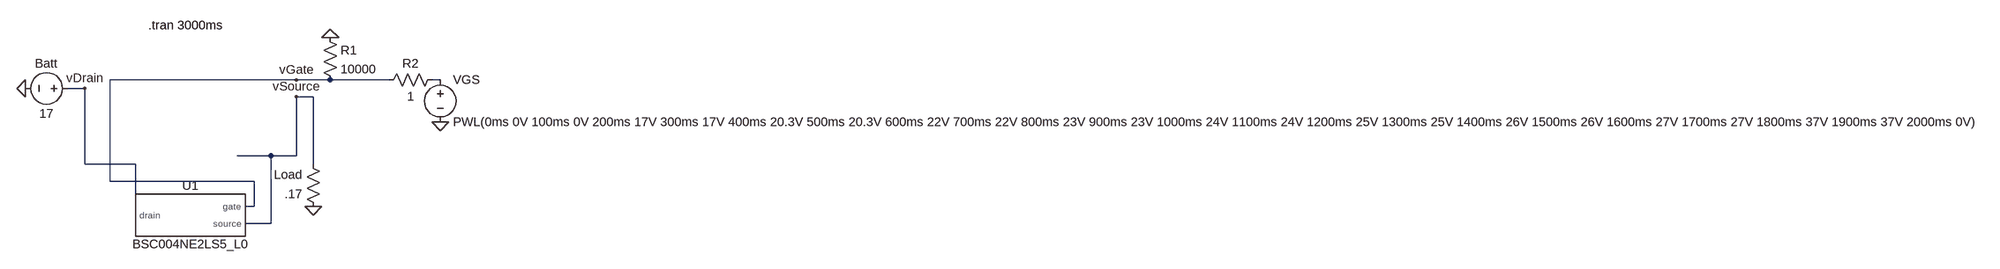
[diagram p0: schematic x_NMOS_SIM.asc]
x_NMOS_SIM.asc, the LTspice schematic file:
Version 4
SHEET 1 3888 808
WIRE 544 304 192 304
WIRE 608 304 544 304
WIRE 720 304 608 304
WIRE 816 304 800 304
WIRE 144 320 112 320
WIRE 576 336 544 336
WIRE 496 448 432 448
WIRE 544 448 544 336
WIRE 544 448 496 448
WIRE 144 464 144 320
WIRE 240 464 144 464
WIRE 576 464 576 336
WIRE 192 496 192 304
WIRE 464 496 192 496
WIRE 464 544 464 496
WIRE 464 544 448 544
WIRE 240 560 240 464
WIRE 496 576 496 448
WIRE 496 576 448 576
FLAG 816 384 0
FLAG 576 544 0
FLAG 32 320 0
FLAG 144 320 vDrain
FLAG 544 304 vGate
FLAG 544 336 vSource
FLAG 608 224 0
SYMBOL Voltage 816 288 R0
SYMATTR InstName VGS
SYMATTR Value PWL(0ms 0V 100ms 0V 200ms 17V 300ms 17V 400ms 20.3V 500ms 20.3V 600ms 22V 700ms 22V 800ms 23V 900ms 23V 1000ms 24V 1100ms 24V 1200ms 25V 1300ms 25V 1400ms 26V 1500ms 26V 1600ms 27V 1700ms 27V 1800ms 37V 1900ms 37V 2000ms 0V)
SYMBOL Voltage 128 320 R90
WINDOW 0 -32 56 VBottom 2
WINDOW 3 32 56 VTop 2
SYMATTR InstName Batt
SYMATTR Value 17
SYMBOL Res 592 560 R180
WINDOW 0 36 76 Left 2
WINDOW 3 36 40 Left 2
SYMATTR InstName Load
SYMATTR Value .17
SYMBOL Res 592 208 R0
SYMATTR InstName R1
SYMATTR Value 10000
SYMBOL Res 816 288 R90
WINDOW 0 0 56 VBottom 2
WINDOW 3 32 56 VTop 2
SYMATTR InstName R2
SYMATTR Value 1
SYMBOL AutoGenerated/BSC004NE2LS5_L0 336 560 R0
SYMATTR InstName U1
TEXT 264 200 Left 2 !.tran 3000ms

The netlist it stands for:
* x_NMOS_SIM.asc
VGS N001 0 PWL(0ms 0V 100ms 0V 200ms 17V 300ms 17V 400ms 20.3V 500ms 20.3V 600ms 22V 700ms 22V 800ms 23V 900ms 23V 1000ms 24V 1100ms 24V 1200ms 25V 1300ms 25V 1400ms 26V 1500ms 26V 1600ms 27V 1700ms 27V 1800ms 37V 1900ms 37V 2000ms 0V)
V§Batt vDrain 0 17
R§Load 0 vSource .17
R1 0 vGate 10000
R2 N001 vGate 1
XU1 vDrain vGate vSource BSC004NE2LS5_L0  ; pins drain gate source
.tran 3000ms
.lib C:\Users\Kyle\Desktop\FetTesting\simFiles\BSC004NE2LS5ATMA1\OptiMOS5 25V Cadence PSpice.lib
.backanno
.end

* Results of the author's LTspice run, read from the files saved beside the schematic
* Operating Point, zero values left out:
*   V(vdrain) = 17 V
*   V(vgate) = 1.7 µV
*   I(Load) = -181.7 pA
*   I(R1) = -170 pA
*   I(R2) = -1.7 µA
*   I(Vgs) = 1.7 µA
*   I(Batt) = -1.7 µA
*   Ix(u1:DRAIN) = 1.7 µA
*   Ix(u1:GATE) = -1.7 µA
*   Ix(u1:SOURCE) = -181.7 pA
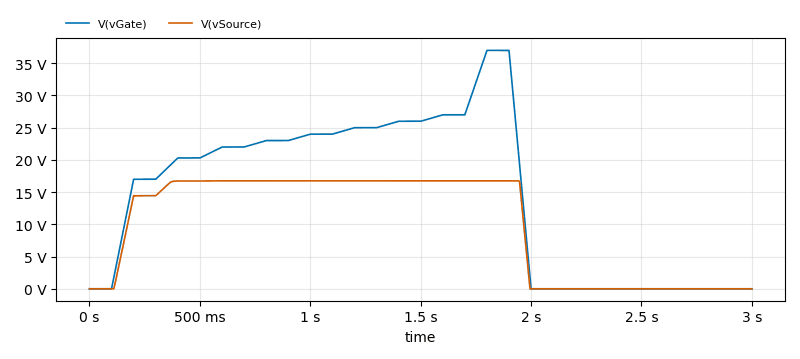
[diagram p1: Transient Analysis of x_NMOS_SIM.asc, plotted from the saved traces]
* Transient Analysis, 1 run:
*   V(vGate): min 0 V, max 37 V, average 14.75 V, rms 19.24 V, last 0 V
*   V(vSource): min 0 V, max 16.77 V, average 10 V, rms 12.8 V, last 0 V